# Altium schematic sheet 25-CURRENT MONITORING DEVICES.SchDoc
size 513 x 386 mm
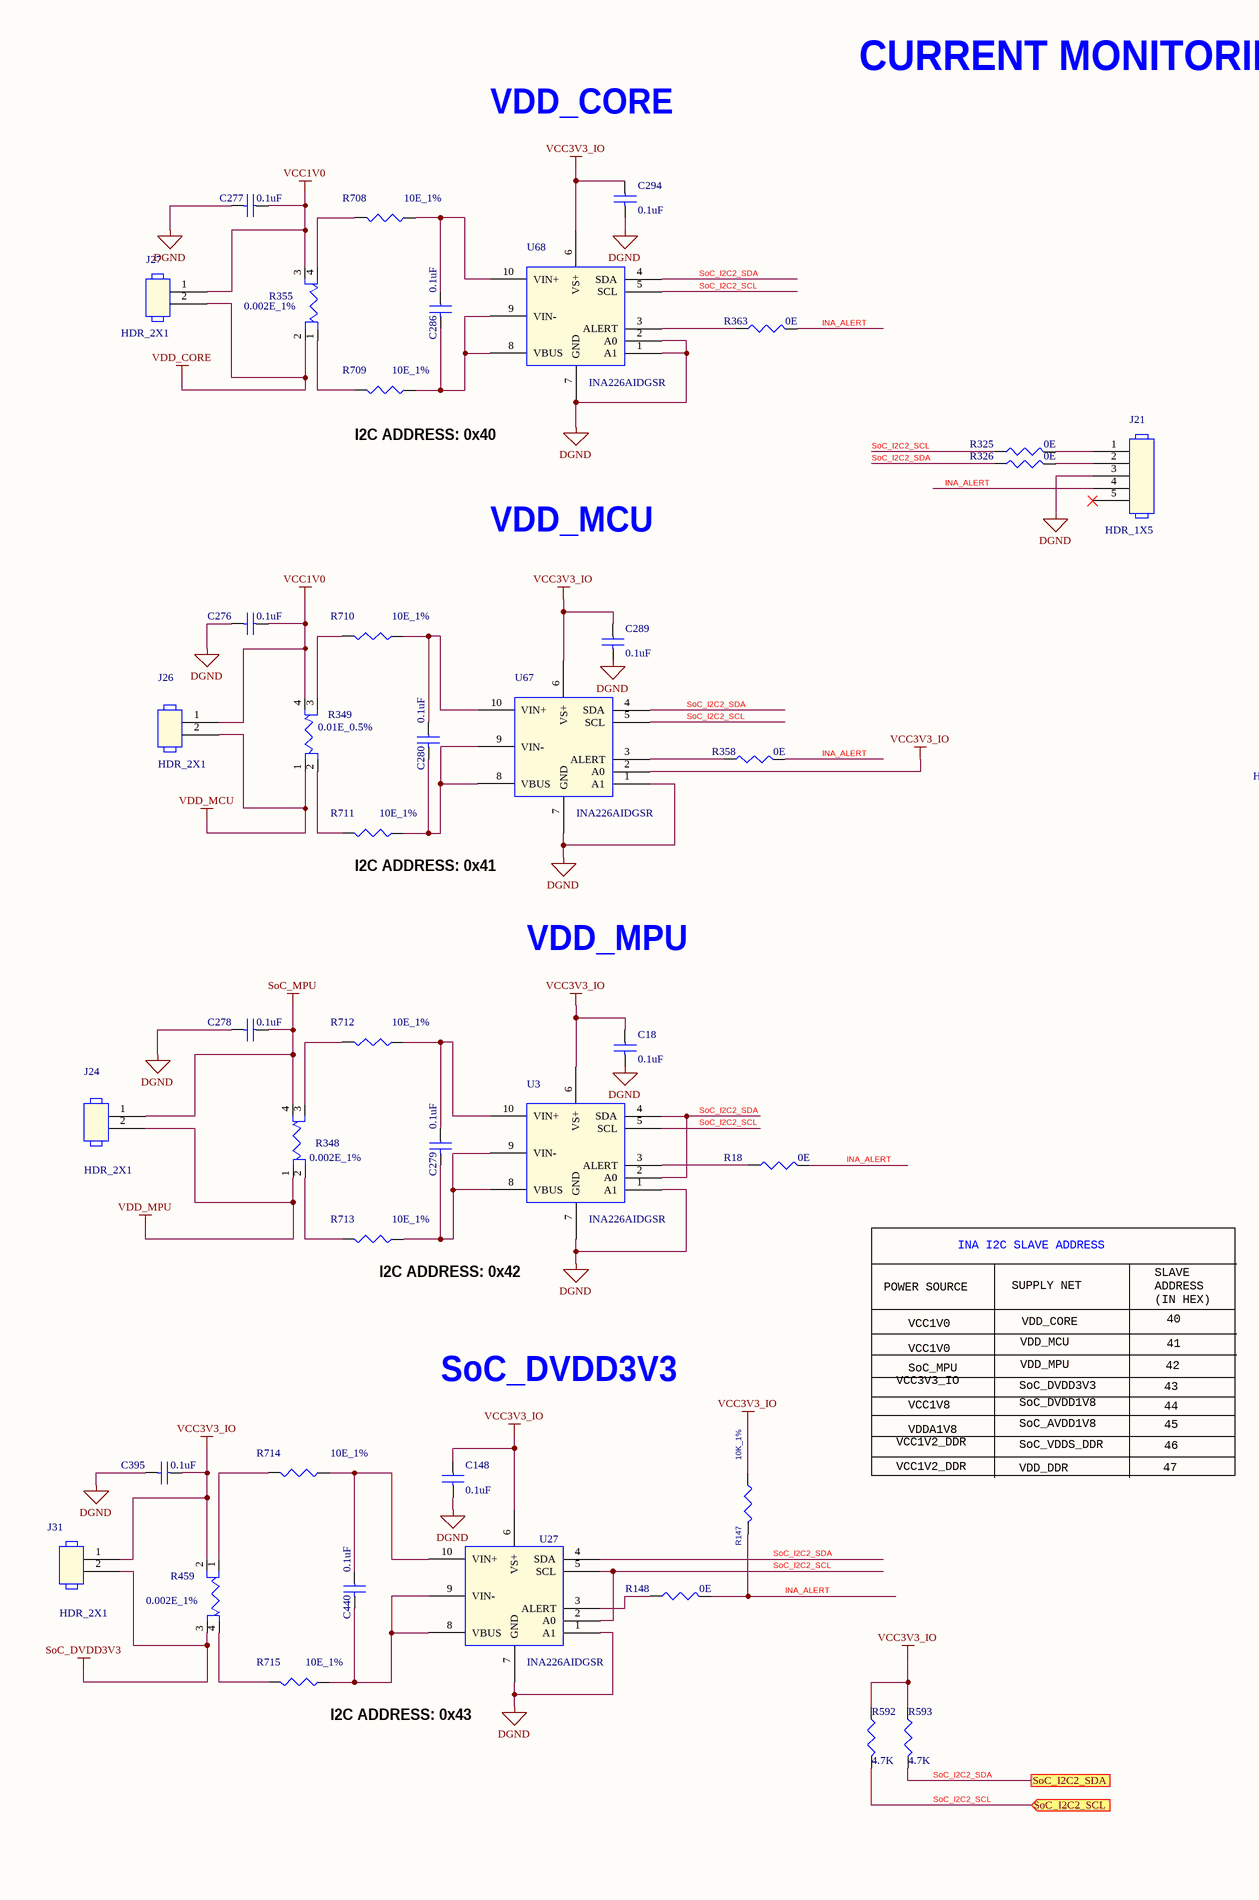
[diagram p0: 25-CURRENT MONITORING DEVICES.SchDoc, left]
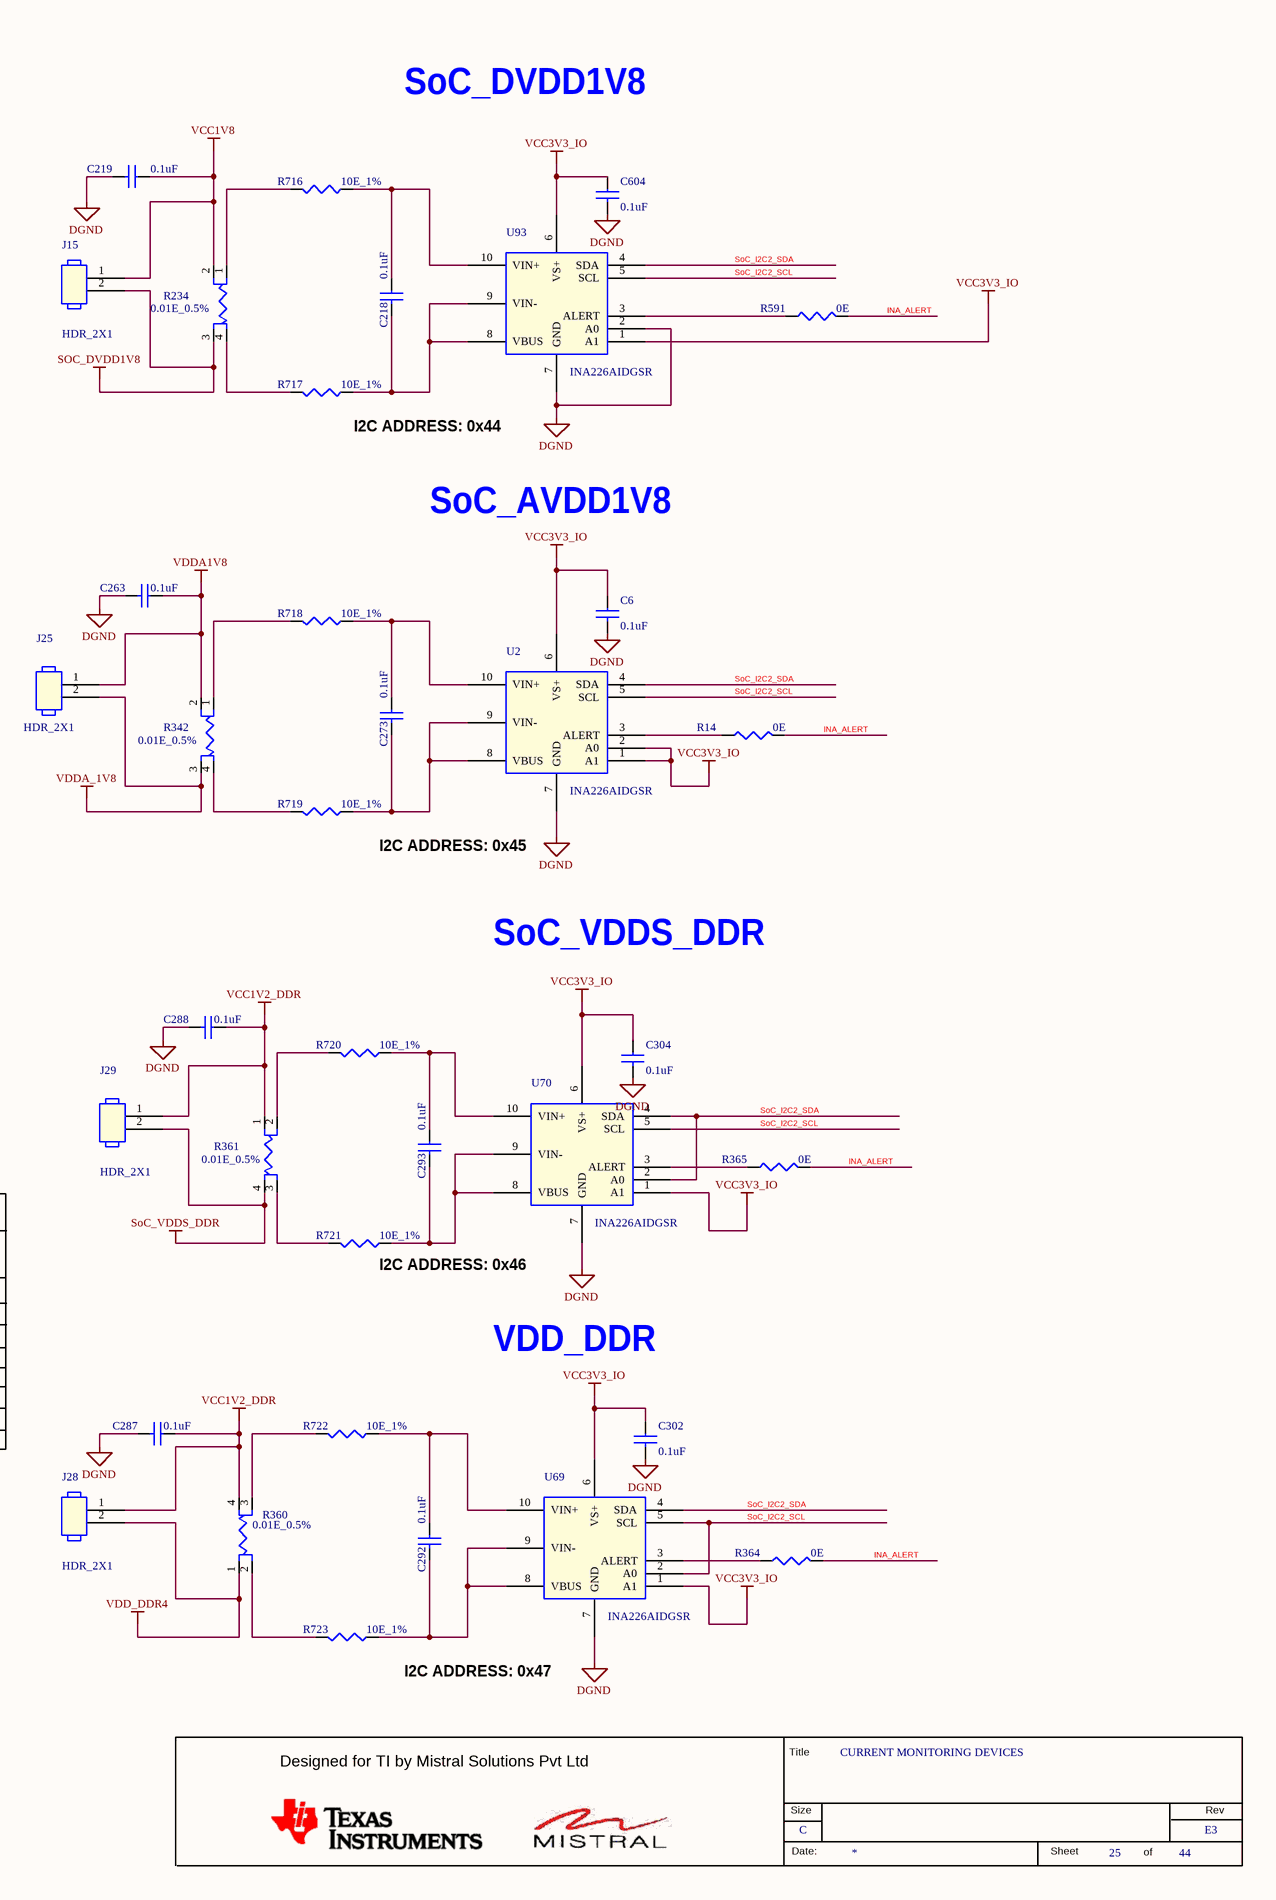
[diagram p1: 25-CURRENT MONITORING DEVICES.SchDoc, right]

## Parts
*  RevCode: E3  Title: CURRENT MONITORING DEVICES  Page Size: C  Page Number: 25  Page Count: 44  (hidden comment: MISTRAL_TITLEBLK_CSIZE)  (graphical)
C6  0.1uF  [CAP0201_0-5]
C18  0.1uF  [CAP0201_0-5]
C148  0.1uF  [CAP0201_0-5]
C218  0.1uF  [CAP0201_0-5]
C219  0.1uF  [CAP0201_0-5]
C263  0.1uF  [CAP0201_0-5]
C273  0.1uF  [CAP0201_0-5]
C276  0.1uF  [CAP0201_0-5]
C277  0.1uF  [CAP0201_0-5]
C278  0.1uF  [CAP0201_0-5]
C279  0.1uF  [CAP0201_0-5]
C280  0.1uF  [CAP0201_0-5]
C286  0.1uF  [CAP0201_0-5]
C287  0.1uF  [CAP0201_0-5]
C288  0.1uF  [CAP0201_0-5]
C289  0.1uF  [CAP0201_0-5]
C292  0.1uF  [CAP0201_0-5]
C293  0.1uF  [CAP0201_0-5]
C294  0.1uF  [CAP0201_0-5]
C302  0.1uF  [CAP0201_0-5]
C304  0.1uF  [CAP0201_0-5]
C395  0.1uF  [CAP0201_0-5]
C440  0.1uF  [CAP0201_0-5]
C604  0.1uF  [CAP0201_0-5]
J15  HDR_2X1  [HDR_2X1_100_S_T_10-8]
J21  HDR_1X5  [HDR_5X1_100_S_T_11-2]
J24  HDR_2X1  [HDR_2X1_100_S_T_10-8]
J25  HDR_2X1  [HDR_2X1_100_S_T_10-8]
J26  HDR_2X1  [HDR_2X1_100_S_T_10-8]
J27  HDR_2X1  [HDR_2X1_100_S_T_10-8]
J28  HDR_2X1  [HDR_2X1_100_S_T_10-8]
J29  HDR_2X1  [HDR_2X1_100_S_T_10-8]
J31  HDR_2X1  [HDR_2X1_100_S_T_10-8]
R14  0E  [RES0402_0-5]
R18  0E  [RES0402_0-5]
R147  10K_1%  [RES0402_0-5]
R148  0E  [RES0402_0-5]
R234  0.01E_0.5%  [RES1206-4TERM_0-75]
R325  0E  [RES0402_0-5]
R326  0E  [RES0402_0-5]
R342  0.01E_0.5%  [RES1206-4TERM_0-75]
R348  0.002E_1%  [RES2512-4TERM_0-75]
R349  0.01E_0.5%  [RES1206-4TERM_0-75]
R355  0.002E_1%  [RES2512-4TERM_0-75]
R358  0E  [RES0402_0-5]
R360  0.01E_0.5%  [RES1206-4TERM_0-75]
R361  0.01E_0.5%  [RES1206-4TERM_0-75]
R363  0E  [RES0402_0-5]
R364  0E  [RES0402_0-5]
R365  0E  [RES0402_0-5]
R459  0.002E_1%  [RES2512-4TERM_0-75]
R591  0E  [RES0402_0-5]
R592  4.7K  [RES0402]
R593  4.7K  [RES0402]
R708  10E_1%  [RES0402_0-5]
R709  10E_1%  [RES0402_0-5]
R710  10E_1%  [RES0402_0-5]
R711  10E_1%  [RES0402_0-5]
R712  10E_1%  [RES0402_0-5]
R713  10E_1%  [RES0402_0-5]
R714  10E_1%  [RES0402_0-5]
R715  10E_1%  [RES0402_0-5]
R716  10E_1%  [RES0402_0-5]
R717  10E_1%  [RES0402_0-5]
R718  10E_1%  [RES0402_0-5]
R719  10E_1%  [RES0402_0-5]
R720  10E_1%  [RES0402_0-5]
R721  10E_1%  [RES0402_0-5]
R722  10E_1%  [RES0402_0-5]
R723  10E_1%  [RES0402_0-5]
U2  INA226AIDGSR  [MSOP10_19-68_120X120_1-1]
U3  INA226AIDGSR  [MSOP10_19-68_120X120_1-1]
U27  INA226AIDGSR  [MSOP10_19-68_120X120_1-1]
U67  INA226AIDGSR  [MSOP10_19-68_120X120_1-1]
U68  INA226AIDGSR  [MSOP10_19-68_120X120_1-1]
U69  INA226AIDGSR  [MSOP10_19-68_120X120_1-1]
U70  INA226AIDGSR  [MSOP10_19-68_120X120_1-1]
U93  INA226AIDGSR  [MSOP10_19-68_120X120_1-1]

## Ports
SoC_I2C2_SCL (in), SoC_I2C2_SDA

## Nets
DGND: C6.2 C18.2 C148.2 C219.2 C263.2 C276.2 C277.2 C278.2 C287.2 C288.2 C289.2 C294.2 C302.2 C304.2 C395.2 C604.2 J21.3 U2.7(GND) U3.1(A1) U3.7(GND) U27.1(A1) U27.7(GND) U67.1(A1) U67.7(GND) U68.1(A1) U68.2(A0) U68.7(GND) U69.7(GND) U70.7(GND) U93.2(A0) U93.7(GND)
SOC_DVDD1V8: J15.2 R234.3
SoC_DVDD3V3: J31.2 R459.3
SoC_MPU: C278.1 J24.1 R348.4
SoC_VDDS_DDR: J29.2 R361.4
VCC1V0: C276.1 C277.1 J26.1 J27.1 R349.4 R355.3
VCC1V2_DDR: C287.1 C288.1 J28.1 J29.1 R360.4 R361.1
VCC1V8: C219.1 J15.1 R234.2
VCC3V3_IO: C6.1 C18.1 C148.1 C289.1 C294.1 C302.1 C304.1 C395.1 C604.1 J31.1 R147.2 R459.2 R592.1 R593.1 U2.1(A1) U2.2(A0) U2.6(VS+) U3.6(VS+) U27.6(VS+) U67.2(A0) U67.6(VS+) U68.6(VS+) U69.1(A1) U69.6(VS+) U70.1(A1) U70.6(VS+) U93.1(A1) U93.6(VS+)
VDD_CORE: J27.2 R355.2
VDD_DDR4: J28.2 R360.1
VDD_MCU: J26.2 R349.1
VDD_MPU: J24.2 R348.1
VDDA1V8: C263.1 J25.1 R342.2
VDDA_1V8: J25.2 R342.3
INA_ALERT: J21.4 R14.2 R18.2 R147.1 R148.2 R358.2 R363.2 R364.2 R365.2 R591.2
SoC_I2C2_SCL: R325.1 R592.2 U2.5(SCL) U3.5(SCL) U27.2(A0) U27.5(SCL) U67.5(SCL) U68.5(SCL) U69.2(A0) U69.5(SCL) U70.5(SCL) U93.5(SCL) ; port SoC_I2C2_SCL
SoC_I2C2_SDA: R326.1 R593.2 U2.4(SDA) U3.2(A0) U3.4(SDA) U27.4(SDA) U67.4(SDA) U68.4(SDA) U69.4(SDA) U70.2(A0) U70.4(SDA) U93.4(SDA) ; port SoC_I2C2_SDA
NetC218_1: C218.1 R716.1 U93.10(VIN+)
NetC218_2: C218.2 R717.1 U93.8(VBUS) U93.9(VIN-)
NetC273_1: C273.1 R718.1 U2.10(VIN+)
NetC273_2: C273.2 R719.1 U2.8(VBUS) U2.9(VIN-)
NetC279_1: C279.1 R712.1 U3.10(VIN+)
NetC279_2: C279.2 R713.1 U3.8(VBUS) U3.9(VIN-)
NetC280_1: C280.1 R710.1 U67.10(VIN+)
NetC280_2: C280.2 R711.1 U67.8(VBUS) U67.9(VIN-)
NetC286_1: C286.1 R708.1 U68.10(VIN+)
NetC286_2: C286.2 R709.1 U68.8(VBUS) U68.9(VIN-)
NetC292_1: C292.1 R722.1 U69.10(VIN+)
NetC292_2: C292.2 R723.1 U69.8(VBUS) U69.9(VIN-)
NetC293_1: C293.1 R720.1 U70.10(VIN+)
NetC293_2: C293.2 R721.1 U70.8(VBUS) U70.9(VIN-)
NetC440_1: C440.1 R714.1 U27.10(VIN+)
NetC440_2: C440.2 R715.1 U27.8(VBUS) U27.9(VIN-)
NetJ21_1: J21.1 R325.2
NetJ21_2: J21.2 R326.2
NetR14_1: R14.1 U2.3(ALERT)
NetR18_1: R18.1 U3.3(ALERT)
NetR148_1: R148.1 U27.3(ALERT)
NetR234_1: R234.1 R716.2
NetR234_4: R234.4 R717.2
NetR342_1: R342.1 R718.2
NetR342_4: R342.4 R719.2
NetR348_2: R348.2 R713.2
NetR348_3: R348.3 R712.2
NetR349_2: R349.2 R711.2
NetR349_3: R349.3 R710.2
NetR355_1: R355.1 R709.2
NetR355_4: R355.4 R708.2
NetR358_1: R358.1 U67.3(ALERT)
NetR360_2: R360.2 R723.2
NetR360_3: R360.3 R722.2
NetR361_2: R361.2 R720.2
NetR361_3: R361.3 R721.2
NetR363_1: R363.1 U68.3(ALERT)
NetR364_1: R364.1 U69.3(ALERT)
NetR365_1: R365.1 U70.3(ALERT)
NetR459_1: R459.1 R714.2
NetR459_4: R459.4 R715.2
NetR591_1: R591.1 U93.3(ALERT)

Not connected (* = marked no-connect by the designer): J21 5*

## Notes on the sheet
- VDD_CORE
- CURRENT MONITORING  DEVICES
- SoC_DVDD1V8
- (near R709) I2C ADDRESS: 0x40
- (near R717) I2C ADDRESS: 0x44
- VDD_MCU
- SoC_AVDD1V8
- (near R711) I2C ADDRESS: 0x41
- I2C ADDRESS: 0x45
- VDD_MPU
- SoC_VDDS_DDR
- (near R713) I2C ADDRESS: 0x42
- POWER SOURCE
- INA I2C SLAVE ADDRESS
- SUPPLY NET
- SLAVE
  ADDRESS
  (IN HEX)
- (near R721) I2C ADDRESS: 0x46
- VCC1V0
- 40
- 41
- SoC_DVDD3V3
- VCC3V3_IO
- SoC_MPU
- VCC1V8
- 43
- 44
- 42
- VDD_DDR
- VCC1V2_DDR
- VDDA1V8
- 47
- 45
- 46
- (near R715) I2C ADDRESS: 0x43
- I2C ADDRESS: 0x47
- (in symbol MISTRAL_TITLEBLK_CSIZE) Title; Designed for TI by Mistral Solutions Pvt Ltd; Size; Rev; Date:; Sheet; of

## Library data of the parts
* = MISTRAL_TITLEBLK_CSIZE: Issue: 1.0; Page Create Date: March  8, 1995; Page Modify Date: *
C6 C148 C304 = CAP_Dup5: CAP CERAMIC 0.1uF 16V 10% X5R 0201; Part_type: CAPACITORS\CERAMIC; Mfr_part_number: GRM033R61C104KE84J; Mfr_name: MURATA; Mistral Part No: 120009030072-R; Custom_Duty: 15%; Customs_HS_Code: 85322990; Wattage: NA; Project: TI_MAXIE_CPB; PCB Footprint: CAP0201_0-5; MECHANICAL 3D STEP FILE: CAP0201_0-5; Chkd/date: MANIRAJA/120218; Crtd /date: MANIRAJA/120218; Datasheet: Y:\MIS_DATABASE\DATASHEETS\CAPACITORS\GRM033R61C104KE84.PDF; Temperature: -55°C+85°C; Weight: 0.33mg; Height: 0.33MM; Distributor_part_number: 490-16742-1-ND; Distributor_name: DIGIKEY; Package: 0201; Voltage: 16V; Tolerance: 10%; Library Ref: CAP
C18 C289 C294 C302 C604 = CAP_Dup5: CAP CERAMIC 0.1uF 16V 10% X5R 0201; Mistral Part No: 120009030072-R; Mfr_name: MURATA; Mfr_part_number: GRM033R61C104KE84J; Part_type: CAPACITORS\CERAMIC; Project: TI_MAXIE_CPB; Wattage: NA; Customs_HS_Code: 85322990; Custom_Duty: 15%; PCB Footprint: CAP0201_0-5; Tolerance: 10%; Voltage: 16V; Package: 0201; Distributor_name: DIGIKEY; Distributor_part_number: 490-16742-1-ND; Height: 0.33MM; Weight: 0.33mg; Temperature: -55°C+85°C; Datasheet: Y:\MIS_DATABASE\DATASHEETS\CAPACITORS\GRM033R61C104KE84.PDF; Crtd /date: MANIRAJA/120218; Chkd/date: MANIRAJA/120218; MECHANICAL 3D STEP FILE: CAP0201_0-5; Library Ref: CAP
C218 C276-C279 C288 = CAP_Dup2: CAP CERAMIC 0.1uF 16V 10% X5R 0201; PART_NUMBER: EC01002; Mfr_name: MURATA; Mfr_part_number: GRM033R61C104KE84J; Part_type: CAPACITORS\CERAMIC; Mistral Part No: 120009030072-R; Project: TI_MAXIE_CPB; Customs_HS_Code: 85322990; Custom_Duty: 15%; Wattage: NA; PCB Footprint: CAP0201_0-5; Tolerance: 10%; Voltage: 16V; Package: 0201; Distributor_name: DIGIKEY; Distributor_part_number: 490-16742-1-ND; Height: 0.33MM; Datasheet: Y:\MIS_DATABASE\DATASHEETS\CAPACITORS\GRM033R61C104KE84.PDF; Crtd /date: MANIRAJA/120218; Chkd/date: MANIRAJA/120218; Taser_part_number: EC01002; Weight: 0.33mg; Temperature: -55°C+85°C; MECHANICAL 3D STEP FILE: CAP0201_0-5; Library Ref: CAP
C219 C395 = CAP_Dup2: CAP CERAMIC 0.1uF 16V 10% X5R 0201; Taser_part_number: EC01002; Mistral Part No: 120009030072-R; Part_type: CAPACITORS\CERAMIC; Mfr_part_number: GRM033R61C104KE84J; Mfr_name: MURATA; Wattage: NA; Custom_Duty: 15%; Customs_HS_Code: 85322990; Project: TI_MAXIE_CPB; PCB Footprint: CAP0201_0-5; MECHANICAL 3D STEP FILE: CAP0201_0-5; Temperature: -55°C+85°C; Weight: 0.33mg; Chkd/date: MANIRAJA/120218; Crtd /date: MANIRAJA/120218; Datasheet: Y:\MIS_DATABASE\DATASHEETS\CAPACITORS\GRM033R61C104KE84.PDF; Height: 0.33MM; Distributor_part_number: 490-16742-1-ND; Distributor_name: DIGIKEY; Package: 0201; Voltage: 16V; Tolerance: 10%; PART_NUMBER: EC01002; Library Ref: CAP
C263 C280 = CAP_Dup2: CAP CERAMIC 0.1uF 16V 10% X5R 0201; PART_NUMBER: EC01002; Mfr_name: MURATA; Mfr_part_number: GRM033R61C104KE84J; Part_type: CAPACITORS\CERAMIC; Mistral Part No: 120009030072-R; Wattage: NA; Project: TI_MAXIE_CPB; Customs_HS_Code: 85322990; Custom_Duty: 15%; PCB Footprint: CAP0201_0-5; MECHANICAL 3D STEP FILE: CAP0201_0-5; Temperature: -55°C+85°C; Weight: 0.33mg; Tolerance: 10%; Voltage: 16V; Package: 0201; Distributor_name: DIGIKEY; Distributor_part_number: 490-16742-1-ND; Height: 0.33MM; Datasheet: Y:\MIS_DATABASE\DATASHEETS\CAPACITORS\GRM033R61C104KE84.PDF; Crtd /date: MANIRAJA/120218; Chkd/date: MANIRAJA/120218; Taser_part_number: EC01002; Library Ref: CAP
C273 C286 C287 C292 C293 C440 = CAP_Dup2: CAP CERAMIC 0.1uF 16V 10% X5R 0201; Taser_part_number: EC01002; Mistral Part No: 120009030072-R; Part_type: CAPACITORS\CERAMIC; Mfr_part_number: GRM033R61C104KE84J; Mfr_name: MURATA; Custom_Duty: 15%; Customs_HS_Code: 85322990; Project: TI_MAXIE_CPB; Wattage: NA; PCB Footprint: CAP0201_0-5; Chkd/date: MANIRAJA/120218; Crtd /date: MANIRAJA/120218; Datasheet: Y:\MIS_DATABASE\DATASHEETS\CAPACITORS\GRM033R61C104KE84.PDF; Height: 0.33MM; Distributor_part_number: 490-16742-1-ND; Distributor_name: DIGIKEY; Package: 0201; Voltage: 16V; Tolerance: 10%; PART_NUMBER: EC01002; Weight: 0.33mg; Temperature: -55°C+85°C; MECHANICAL 3D STEP FILE: CAP0201_0-5; Library Ref: CAP
J15 J24 J31 = HEADER_2X1: CON HDR 2X1 2.54MM PITCH ST TH; Part_type: CONNECTOR\HEADERS; Mfr_name: MOLEX; Mistral Part No: 150009030246-R; Custom_Duty: 24%; Customs_HS_Code: 85369090; Project: FPGA EXTENDER CARD; Tolerance: NA; PCB Footprint: HDR_2X1_100_S_T_10-8; Chkd/date: VASANTHA/060117; Crtd /date: MAZHAR/280405; Datasheet: Y:\MIS_DATABASE\DATASHEETS\CONNECTORS\HEADER_X4030.PDF; Height: 10.79MM; Distributor_part_number: WM4000-ND; Distributor_name: DIGIKEY; Package: THRU-HOLE; Mfr_part_number: 22-03-2021; Voltage: NA; Wattage: NA; Weight: 139gm; Temperature: -0°C+75°C; MECHANICAL 3D STEP FILE: HDR_2X1_100_S_T_10-8; Library Path: Y:\MIS_DATABASE\Library\ALTIUM_TOOL\SCHEMATICS_PARTS\MS_Connector_Library.schlib; Footprint Path: Y:\MIS_DATABASE\Library\ALTIUM_TOOL\PCB_FOOTPRINTS\Altium_Footprint_Lib.PcbLib; Library Ref: HEADER_2X1; Footprint Ref: HDR_2X1_100_S_T_10-8
J21 = HEADER_5X1: CON HDR 1X5 2.54MM PITCH ST TH; Mistral Part No: 150009030262-R; Mfr_name: MOLEX; Part_type: CONNECTOR\HEADERS; Wattage: NA; Project: HSWD; Customs_HS_Code: 85369090; Custom_Duty: 24%; PCB Footprint: HDR_5X1_100_S_T_11-2; MECHANICAL 3D STEP FILE: HDR_5X1_100_S_T_11-2; Temperature: NA; Weight: 343mg; Voltage: NA; Tolerance: NA; Mfr_part_number: 22-03-2051; Package: THRU-HOLE; Distributor_name: DIGIKEY; Distributor_part_number: WM4003-ND; Height: 11.17MM; Datasheet: Y:\MIS_DATABASE\DATASHEETS\CONNECTORS\MOLEX022032021.PDF; Crtd /date: MAZHAR/280405; Chkd/date: VASANTHA/310117; Library Ref: HEADER_5X1
J25-J29 = HEADER_2X1: CON HDR 2X1 2.54MM PITCH ST TH; Mistral Part No: 150009030246-R; Mfr_name: MOLEX; Part_type: CONNECTOR\HEADERS; Wattage: NA; Project: FPGA EXTENDER CARD; Customs_HS_Code: 85369090; Custom_Duty: 24%; PCB Footprint: HDR_2X1_100_S_T_10-8; Footprint Path: Y:\MIS_DATABASE\Library\ALTIUM_TOOL\PCB_FOOTPRINTS\Altium_Footprint_Lib.PcbLib; Library Path: Y:\MIS_DATABASE\Library\ALTIUM_TOOL\SCHEMATICS_PARTS\MS_Connector_Library.schlib; MECHANICAL 3D STEP FILE: HDR_2X1_100_S_T_10-8; Temperature: -0°C+75°C; Weight: 139gm; Voltage: NA; Tolerance: NA; Mfr_part_number: 22-03-2021; Package: THRU-HOLE; Distributor_name: DIGIKEY; Distributor_part_number: WM4000-ND; Height: 10.79MM; Datasheet: Y:\MIS_DATABASE\DATASHEETS\CONNECTORS\HEADER_X4030.PDF; Crtd /date: MAZHAR/280405; Chkd/date: VASANTHA/060117; Library Ref: HEADER_2X1; Footprint Ref: HDR_2X1_100_S_T_10-8
R14 R364 R365 R591 = RESISTOR_Dup4: RES 0E 1/16W 0402; Part_type: RESISTORS\FIXED; Mfr_part_number: CRCW04020000Z0ED; Mfr_name: VISHAY; Mistral Part No: 110010080019-P; Custom_Duty: 15%; Customs_HS_Code: 85332119; Voltage: NA; Project: PB_BUGBASE; NI_MARK: DNI; RoHS: Pb-Free; Chkd/date: VASANTHA/201216; Crtd /date: MUDDU/190810; Datasheet: Y:\MIS_DATABASE\DATASHEETS\RESISTORS\CRCW0603.PDF; Temperature: -55°C+155°C; Weight: 0.65g/1000pcs; Height: 0.40MM; Distributor_part_number: 541-0.0JCT-ND; Distributor_name: DIGIKEY; Package: 0402; Wattage: 1/16W; Tolerance: NA; PCB Footprint: RES0402_0-5; MECHANICAL 3D STEP FILE: RES0402_0-5; Library Ref: RESISTOR; Footprint Ref: RES0402_0-5; Library Path: Y:\MIS_DATABASE\Library\ALTIUM_TOOL\SCHEMATICS_PARTS\MS_DISCRETE_Library.schlib; Footprint Path: Y:\MIS_DATABASE\Library\ALTIUM_TOOL\PCB_FOOTPRINTS\Altium_Footprint_Lib.PcbLib
R18 R148 R358 R363 = RESISTOR_Dup4: RES 0E 1/16W 0402; Mistral Part No: 110010080019-P; Mfr_name: VISHAY; Mfr_part_number: CRCW04020000Z0ED; Part_type: RESISTORS\FIXED; Project: PB_BUGBASE; Tolerance: NA; Customs_HS_Code: 85332119; Custom_Duty: 15%; NI_MARK: DNI; Voltage: NA; Wattage: 1/16W; Package: 0402; Distributor_name: DIGIKEY; Distributor_part_number: 541-0.0JCT-ND; Height: 0.40MM; Weight: 0.65g/1000pcs; Temperature: -55°C+155°C; Datasheet: Y:\MIS_DATABASE\DATASHEETS\RESISTORS\CRCW0603.PDF; Crtd /date: MUDDU/190810; Chkd/date: VASANTHA/201216; RoHS: Pb-Free; PCB Footprint: RES0402_0-5; MECHANICAL 3D STEP FILE: RES0402_0-5; Library Ref: RESISTOR; Footprint Ref: RES0402_0-5; Library Path: Y:\MIS_DATABASE\Library\ALTIUM_TOOL\SCHEMATICS_PARTS\MS_DISCRETE_Library.schlib; Footprint Path: Y:\MIS_DATABASE\Library\ALTIUM_TOOL\PCB_FOOTPRINTS\Altium_Footprint_Lib.PcbLib
R147 = RESISTOR_Dup2: RES 10K 1/16W 1% 0402; Mistral Part No: 110009030220-P; Mfr_name: YAGEO AMERICA; Mfr_part_number: RC0402FR-0710KL; Part_type: RESISTORS\FIXED; Project: VOCERA; Customs_HS_Code: 85332119; Custom_Duty: 15%; Voltage: NA; Tolerance: 1%; Wattage: 1/16W; Package: 0402; Distributor_name: DIGIKEY; Distributor_part_number: 311-10.0KLRTR-ND; Height: 0.40MM; Datasheet: Y:\MIS_DATABASE\DATASHEETS\RESISTORS\YAGEO-RC0402.PDF; Crtd /date: GEETHA/290506; Chkd/date: VASANTHA/201216; RoHS: Pb-Free; PCB Footprint: RES0402_0-5; Weight: 0.65mg; Temperature: -55°C+155°C; MECHANICAL 3D STEP FILE: RES0402_0-5; Library Ref: RESISTOR; Footprint Ref: RES0402_0-5; Library Path: Y:\MIS_DATABASE\Library\ALTIUM_TOOL\SCHEMATICS_PARTS\MS_DISCRETE_Library.schlib; Footprint Path: Y:\MIS_DATABASE\Library\ALTIUM_TOOL\PCB_FOOTPRINTS\Altium_Footprint_Lib.PcbLib
R234 R342 R349 R360 = RESISTOR-4TERM: RES 0.01E 1/2W 0.5% 4-TERM1206; Part_type: RESISTORS\FIXED; Mfr_part_number: LVK12R010DER; Mfr_name: OHMITE; Mistral Part No: 110017090009-R; Custom_Duty: 15%; Customs_HS_Code: 85332119; Voltage: NA; Project: TI_MAXIE_CPB; PCB Footprint: RES1206-4TERM_0-75; MECHANICAL 3D STEP FILE: RES1206-4TERM_0-75; Chkd/date: MANIRAJA/260917; Crtd /date: MANIRAJA/260917; Datasheet: Y:\MIS_DATABASE\DATASHEETS\RESISTORS\LVK-SERIES.PDF; Temperature: -40°C+125°C; Weight: 16.2mg; Height: 0.65MM; Distributor_part_number: LVK12R010DERCT-ND; Distributor_name: DIGIKEY; Package: 1206-4TERM; Wattage: 1/2W; Tolerance: 0.5%; Library Ref: RESISTOR-4TERM
R325 = RESISTOR_Dup4: RES 0E 1/16W 0402; Mistral Part No: 110010080019-P; Mfr_name: VISHAY; Mfr_part_number: CRCW04020000Z0ED; Part_type: RESISTORS\FIXED; Project: PB_BUGBASE; Tolerance: NA; Customs_HS_Code: 85332119; Custom_Duty: 15%; PCB Footprint: RES0402_0-5; MECHANICAL 3D STEP FILE: RES0402_0-5; Voltage: NA; Wattage: 1/16W; Package: 0402; Distributor_name: DIGIKEY; Distributor_part_number: 541-0.0JCT-ND; Height: 0.40MM; Weight: 0.65g/1000pcs; Temperature: -55°C+155°C; Datasheet: Y:\MIS_DATABASE\DATASHEETS\RESISTORS\CRCW0603.PDF; Crtd /date: MUDDU/190810; Chkd/date: VASANTHA/201216; RoHS: Pb-Free; Library Ref: RESISTOR; Footprint Ref: RES0402_0-5; Library Path: Y:\MIS_DATABASE\Library\ALTIUM_TOOL\SCHEMATICS_PARTS\MS_DISCRETE_Library.schlib; Footprint Path: Y:\MIS_DATABASE\Library\ALTIUM_TOOL\PCB_FOOTPRINTS\Altium_Footprint_Lib.PcbLib
R326 = RESISTOR_Dup4: RES 0E 1/16W 0402; Part_type: RESISTORS\FIXED; Mfr_part_number: CRCW04020000Z0ED; Mfr_name: VISHAY; Mistral Part No: 110010080019-P; Custom_Duty: 15%; Customs_HS_Code: 85332119; Voltage: NA; Project: PB_BUGBASE; PCB Footprint: RES0402_0-5; MECHANICAL 3D STEP FILE: RES0402_0-5; RoHS: Pb-Free; Chkd/date: VASANTHA/201216; Crtd /date: MUDDU/190810; Datasheet: Y:\MIS_DATABASE\DATASHEETS\RESISTORS\CRCW0603.PDF; Temperature: -55°C+155°C; Weight: 0.65g/1000pcs; Height: 0.40MM; Distributor_part_number: 541-0.0JCT-ND; Distributor_name: DIGIKEY; Package: 0402; Wattage: 1/16W; Tolerance: NA; Library Ref: RESISTOR; Footprint Ref: RES0402_0-5; Library Path: Y:\MIS_DATABASE\Library\ALTIUM_TOOL\SCHEMATICS_PARTS\MS_DISCRETE_Library.schlib; Footprint Path: Y:\MIS_DATABASE\Library\ALTIUM_TOOL\PCB_FOOTPRINTS\Altium_Footprint_Lib.PcbLib
R348 = RESISTOR-4TERM: RES 0.002E 2W 1% 4-TERM2512; Part_type: RESISTORS\FIXED; Mfr_part_number: LVK25R002FER; Mfr_name: OHMITE; Mistral Part No: 110017090010-R; Custom_Duty: 15%; Customs_HS_Code: 85332119; Voltage: NA; Project: TI_MAXIE_CPB; PCB Footprint: RES2512-4TERM_0-75; MECHANICAL 3D STEP FILE: RES2512-4TERM_0-75; Chkd/date: MANIRAJA/260917; Crtd /date: MANIRAJA/260917; Datasheet: Y:\MIS_DATABASE\DATASHEETS\RESISTORS\LVK-SERIES.PDF; Temperature: -40°C+125°C; Weight: NA; Height: 0.70MM; Distributor_part_number: LVK25R002FERCT-ND; Distributor_name: DIGIKEY; Package: 2512-4TERM; Wattage: 2W; Tolerance: 1%; Library Ref: RESISTOR-4TERM
R355 R459 = RESISTOR-4TERM: RES 0.002E 2W 1% 4-TERM2512; Mistral Part No: 110017090010-R; Mfr_name: OHMITE; Mfr_part_number: LVK25R002FER; Part_type: RESISTORS\FIXED; Project: TI_MAXIE_CPB; Voltage: NA; Customs_HS_Code: 85332119; Custom_Duty: 15%; PCB Footprint: RES2512-4TERM_0-75; Tolerance: 1%; Wattage: 2W; Package: 2512-4TERM; Distributor_name: DIGIKEY; Distributor_part_number: LVK25R002FERCT-ND; Height: 0.70MM; Weight: NA; Temperature: -40°C+125°C; Datasheet: Y:\MIS_DATABASE\DATASHEETS\RESISTORS\LVK-SERIES.PDF; Crtd /date: MANIRAJA/260917; Chkd/date: MANIRAJA/260917; MECHANICAL 3D STEP FILE: RES2512-4TERM_0-75; Library Ref: RESISTOR-4TERM
R361 = RESISTOR-4TERM: RES 0.01E 1/2W 0.5% 4-TERM1206; Mistral Part No: 110017090009-R; Mfr_name: OHMITE; Mfr_part_number: LVK12R010DER; Part_type: RESISTORS\FIXED; Project: TI_MAXIE_CPB; Voltage: NA; Customs_HS_Code: 85332119; Custom_Duty: 15%; PCB Footprint: RES1206-4TERM_0-75; Tolerance: 0.5%; Wattage: 1/2W; Package: 1206-4TERM; Distributor_name: DIGIKEY; Distributor_part_number: LVK12R010DERCT-ND; Height: 0.65MM; Weight: 16.2mg; Temperature: -40°C+125°C; Datasheet: Y:\MIS_DATABASE\DATASHEETS\RESISTORS\LVK-SERIES.PDF; Crtd /date: MANIRAJA/260917; Chkd/date: MANIRAJA/260917; MECHANICAL 3D STEP FILE: RES1206-4TERM_0-75; Library Ref: RESISTOR-4TERM
R592 R593 = RESISTOR_Dup3: RES 4.7K 1/16W 5% 0402; Part_type: RESISTORS\FIXED; Mfr_part_number: RC0402JR-074K7L; Mfr_name: YAGEO AMERICA; Mistral Part No: 110009030792-R; Custom_Duty: 15%; Customs_HS_Code: 85332119; Voltage: NA; Project: TMDXCSK368; Chkd/date: VASANTHA/130516; Crtd /date: VASANTHA/130516; Datasheet: Y:\MIS_DATABASE\DATASHEETS\RESISTORS\YAGEO-RC0402.PDF; Temperature: -55°C+155°C; Weight: NA; Height: 0.55MM; Distributor_part_number: 311-4.7KJRCT-ND; Distributor_name: DIGIKEY; Package: 0402; Wattage: 1/16W; Tolerance: 5%; PCB Footprint: RES0402; Library Ref: RESISTOR
R708 R711-R713 = RESISTOR_Dup5: RES 10E 1/16W 1% 0402; Mistral Part No: 110018020004-R; Mfr_name: YAGEO AMERICA; Mfr_part_number: RC0402FR-0710RL; Part_type: RESISTORS\FIXED; Project: TI_MAXIE_CPB; Voltage: NA; Customs_HS_Code: 85332119; Custom_Duty: 15%; PCB Footprint: RES0402_0-5; Tolerance: 1%; Wattage: 1/16W; Package: 0402; Distributor_name: DIGIKEY; Distributor_part_number: 311-10.0LRCT-ND; Height: 0.40MM; Weight: 0.65mg; Temperature: -55°C+155°C; Datasheet: Y:\MIS_DATABASE\DATASHEETS\RESISTORS\YAGEO-RC0402.PDF; Crtd /date: ALVY/070218; Chkd/date: MANIRAJA/070218; MECHANICAL 3D STEP FILE: RES0402_0-5; Library Ref: RESISTOR
R709 R710 R714-R723 = RESISTOR_Dup5: RES 10E 1/16W 1% 0402; Part_type: RESISTORS\FIXED; Mfr_part_number: RC0402FR-0710RL; Mfr_name: YAGEO AMERICA; Mistral Part No: 110018020004-R; Custom_Duty: 15%; Customs_HS_Code: 85332119; Voltage: NA; Project: TI_MAXIE_CPB; PCB Footprint: RES0402_0-5; MECHANICAL 3D STEP FILE: RES0402_0-5; Chkd/date: MANIRAJA/070218; Crtd /date: ALVY/070218; Datasheet: Y:\MIS_DATABASE\DATASHEETS\RESISTORS\YAGEO-RC0402.PDF; Temperature: -55°C+155°C; Weight: 0.65mg; Height: 0.40MM; Distributor_part_number: 311-10.0LRCT-ND; Distributor_name: DIGIKEY; Package: 0402; Wattage: 1/16W; Tolerance: 1%; Library Ref: RESISTOR
U2 U68 U70 = INA226AIDGS_MSOP10: IC BI-DIRECTIONAL CURRENT MONITER MSOP10; Mistral Part No: 141011080019-R; Mfr_name: TEXAS INSTRUMENTS; Part_type: ICS\INTERFACE; Project: DM385EVM_BASE-BOARD; Tolerance: NA; Customs_HS_Code: 85423100; Custom_Duty: 15%; Chkd/date: MANIRAJA/050417; Mfr_part_number: INA226AIDGSR; Voltage: NA; Wattage: NA; Package: MSOP10; Distributor_name: DIGIKEY; Distributor_part_number: 296-29034-1-ND; Height: 1.10MM; Weight: NA; Temperature: -40°C+125°C; Datasheet: Y:\MIS_DATABASE\DATASHEETS\ICS\INTERFACE\INA226.PDF; Crtd /date: MANIRAJA/050417; PCB Footprint: MSOP10_19-68_120X120_1-1; MECHANICAL 3D STEP FILE: MSOP10_19-68_120X120_1-1; Library Ref: INA226AIDGS_MSOP10; Footprint Ref: MSOP10_19-68_120X120_1-1; Library Path: Y:\MIS_DATABASE\Library\ALTIUM_TOOL\SCHEMATICS_PARTS\MS_MISCINTERFACE_Library.schlib; Footprint Path: Y:\MIS_DATABASE\Library\ALTIUM_TOOL\PCB_FOOTPRINTS\Altium_Footprint_Lib.PcbLib
U3 U27 U67 U69 U93 = INA226AIDGS_MSOP10: IC BI-DIRECTIONAL CURRENT MONITER MSOP10; Part_type: ICS\INTERFACE; Mfr_name: TEXAS INSTRUMENTS; Mistral Part No: 141011080019-R; Custom_Duty: 15%; Customs_HS_Code: 85423100; Wattage: NA; Project: DM385EVM_BASE-BOARD; Crtd /date: MANIRAJA/050417; Datasheet: Y:\MIS_DATABASE\DATASHEETS\ICS\INTERFACE\INA226.PDF; Temperature: -40°C+125°C; Weight: NA; Height: 1.10MM; Distributor_part_number: 296-29034-1-ND; Distributor_name: DIGIKEY; Package: MSOP10; Voltage: NA; Tolerance: NA; Mfr_part_number: INA226AIDGSR; Chkd/date: MANIRAJA/050417; PCB Footprint: MSOP10_19-68_120X120_1-1; MECHANICAL 3D STEP FILE: MSOP10_19-68_120X120_1-1; Library Ref: INA226AIDGS_MSOP10; Footprint Ref: MSOP10_19-68_120X120_1-1; Library Path: Y:\MIS_DATABASE\Library\ALTIUM_TOOL\SCHEMATICS_PARTS\MS_MISCINTERFACE_Library.schlib; Footprint Path: Y:\MIS_DATABASE\Library\ALTIUM_TOOL\PCB_FOOTPRINTS\Altium_Footprint_Lib.PcbLib